# Altium schematic sheet 实验平台2.SchDoc
size D
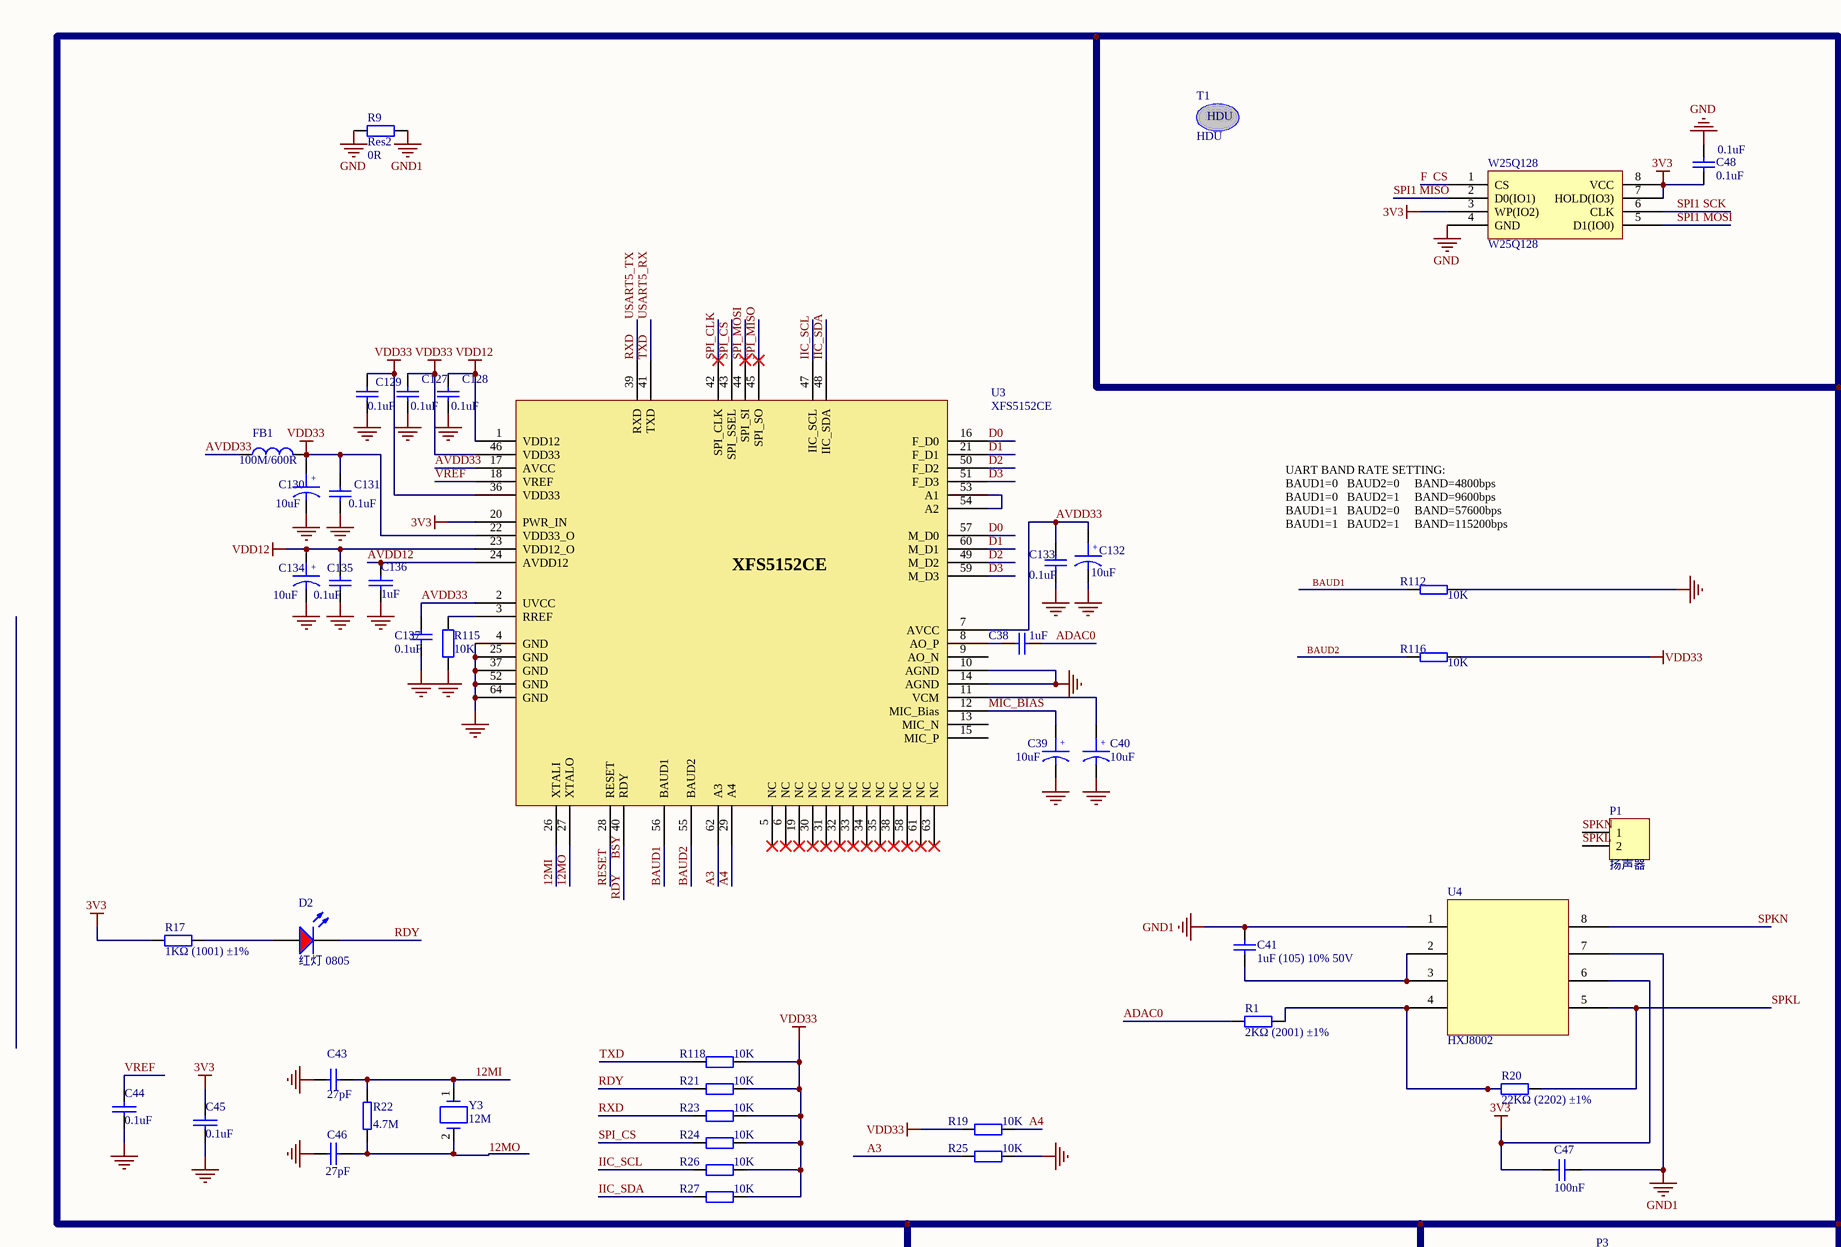
[diagram p0: 实验平台2.SchDoc, top left]
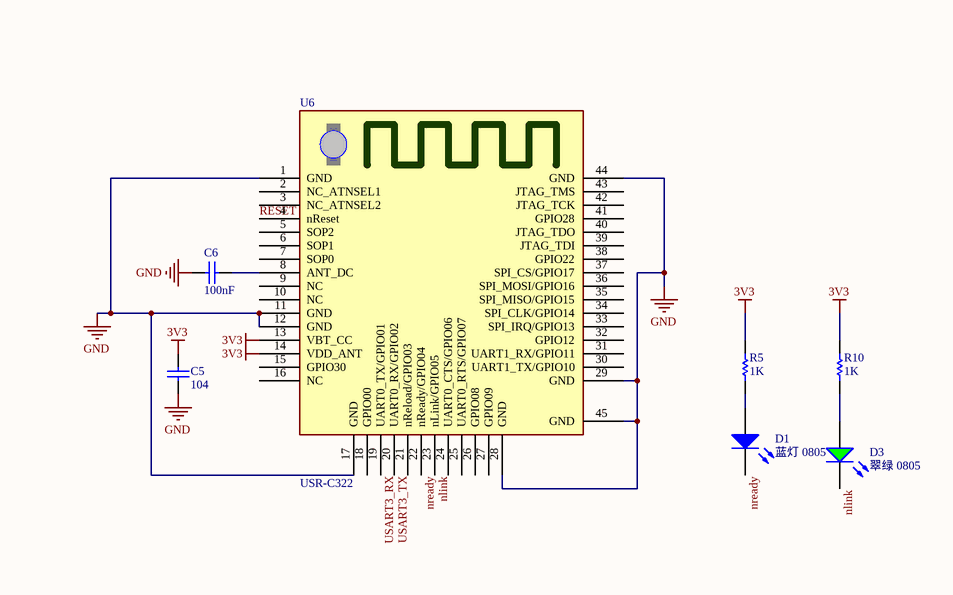
[diagram p1: 实验平台2.SchDoc, top right]
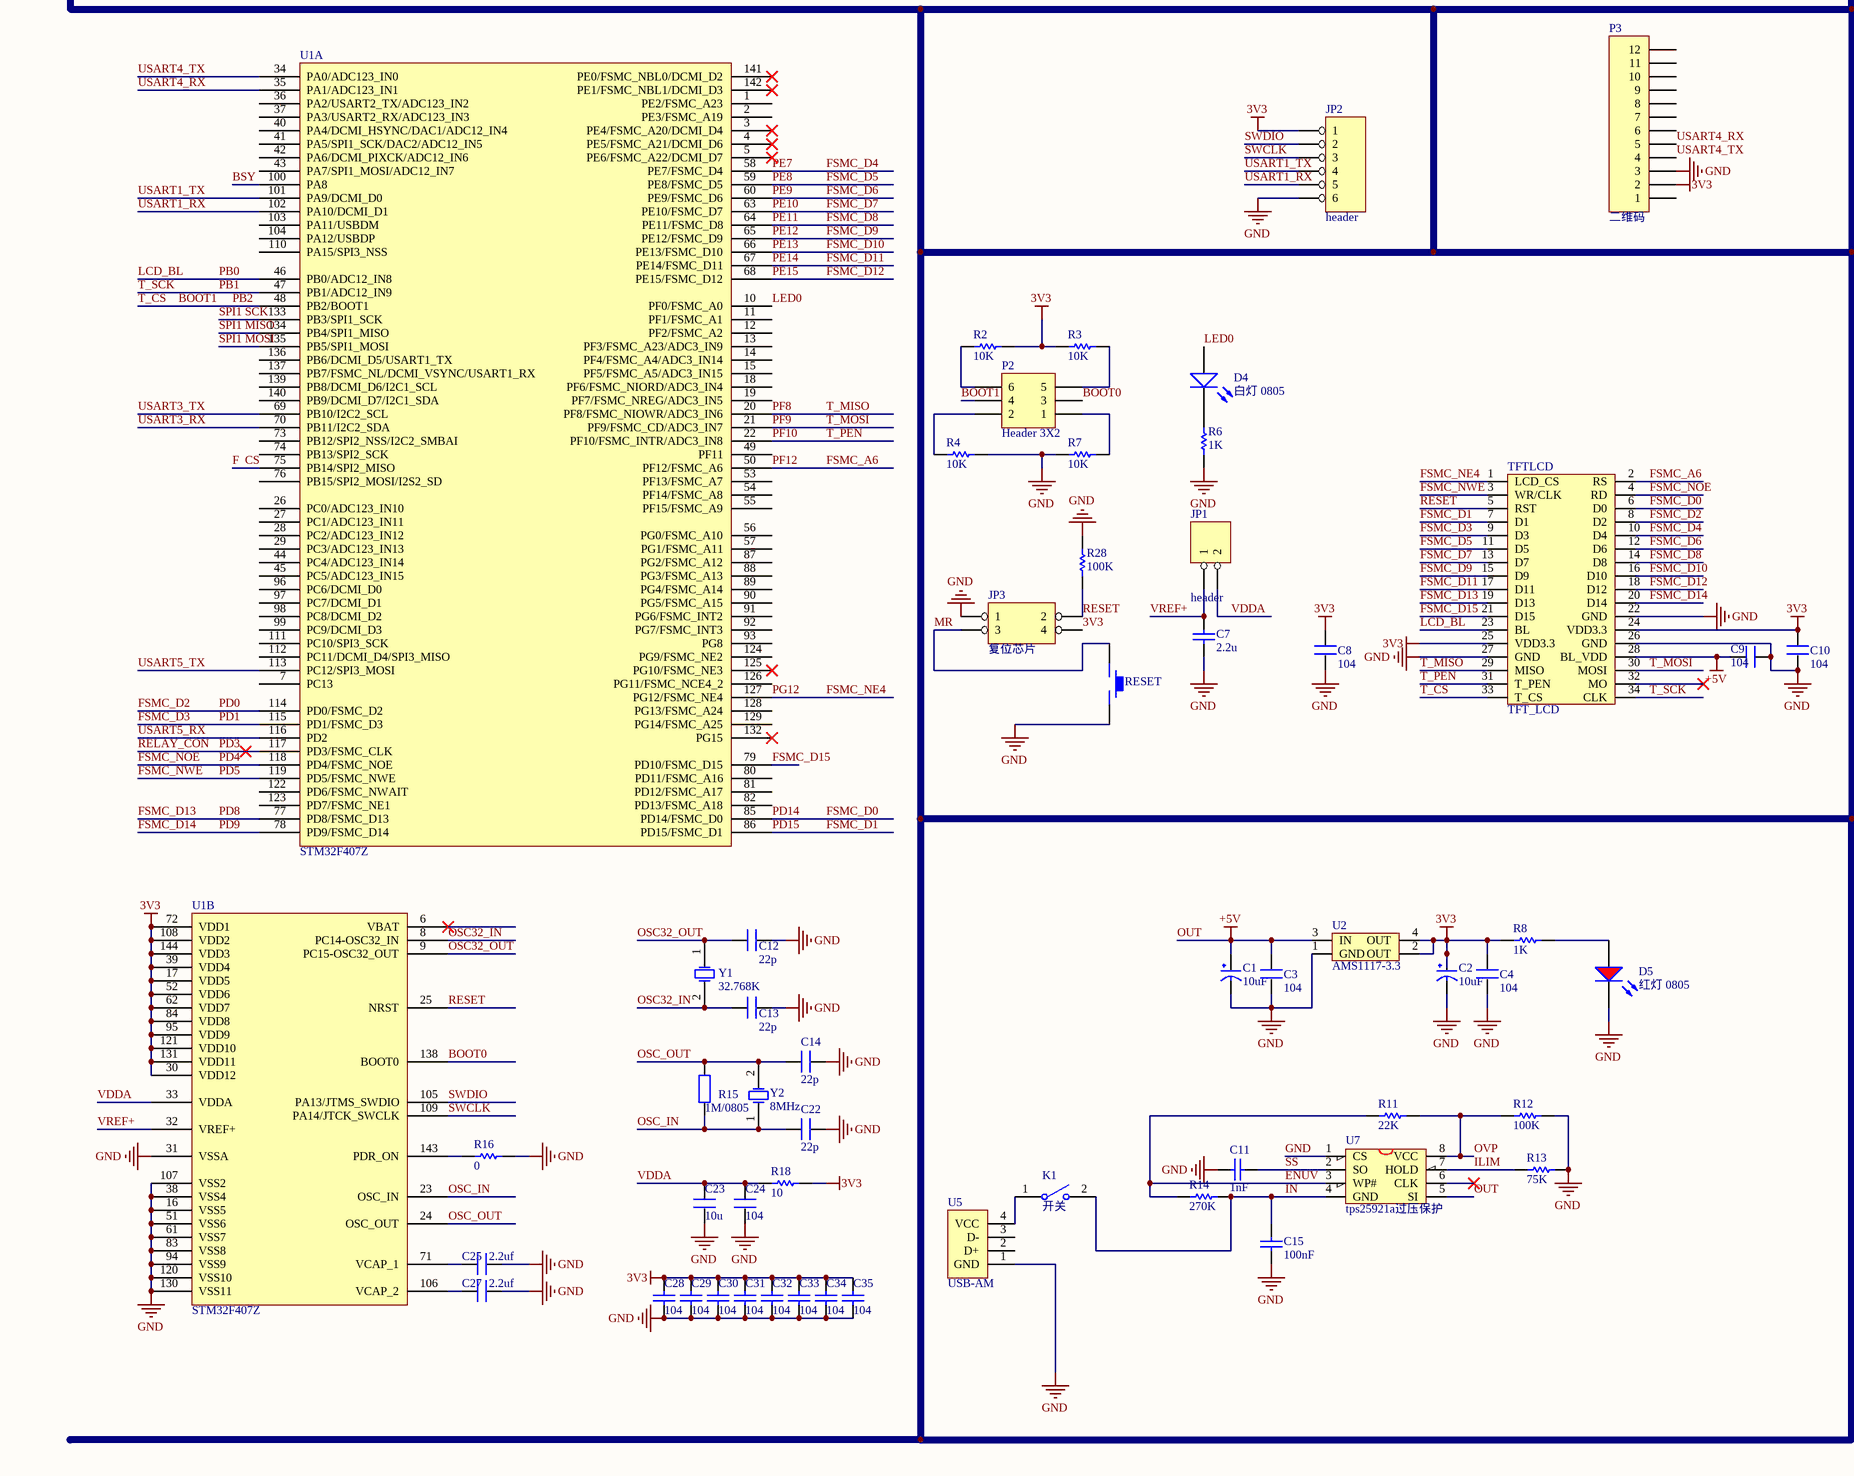
[diagram p2: 实验平台2.SchDoc, bottom left]

## Parts
C1  10uF  [0603_c]
C2  10uF  [0603_c]
C3  104  [0603_c]
C4  104  [0603_c]
C5  104  [0603_c]
C6  100nF  [0603_C]
C7  2.2u  [0603_c]
C8  104  [0603_c]
C9  104  [0603_c]
C10  104  [0603_c]
C11  1nF  [0603_C]
C12  22p  [0603_c]
C13  22p  [0603_c]
C14  22p  [0603_c]
C15  100nF  [0603_C]
C22  22p  [0603_c]
C23  10u  [0603_c]
C24  104  [0603_c]
C25  2.2uf  [0603_c]
C27  2.2uf  [0603_c]
C28  104  [0603_c]
C29  104  [0603_c]
C30  104  [0603_c]
C31  104  [0603_c]
C32  104  [0603_c]
C33  104  [0603_c]
C34  104  [0603_c]
C35  104  [0603_c]
C38  1uF  [C0603(1608)]
C39  10uF  [C0603(1608)]
C40  10uF  [C0603(1608)]
C41  1uF (105) 10% 50V  [0603_C]
C43  27pF  [C0603(1608)]
C44  0.1uF  [C0603(1608)]
C45  0.1uF  [C0603(1608)]
C46  27pF  [C0603(1608)]
C47  100nF  [C-0603]
C48  0.1uF  [0603_C]
C127  0.1uF  [C0603(1608)]
C128  0.1uF  [C0603(1608)]
C129  0.1uF  [C0603(1608)]
C130  10uF  [C0603(1608)]
C131  0.1uF  [C0603(1608)]
C132  10uF  [C0603(1608)]
C133  0.1uF  [C0603(1608)]
C134  10uF  [C0603(1608)]
C135  0.1uF  [C0603(1608)]
C136  1uF  [C0603(1608)]
C137  0.1uF  [C0603(1608)]
D1  蓝灯 0805  [0805_LED_S1]
D2  红灯 0805  [0805_LED_S1]
D3  翠绿 0805  [0805_LED_S1]
D4  白灯 0805  [0805_LED_S1]
D5  红灯 0805  [0805_LED_S1]
FB1  100M/600R  [B0603]
JP1  header  [header2]
JP2  header  [header6HA]
JP3  复位芯片  [SOT-143_M]
K1  开关  [kaiguan]
P1  扬声器  [HDR1X2]
P2  Header 3X2  [HDR2X3]
P3  二维码  [FH12A-12S-0.5sH]
R1  2KΩ (2001) ±1%  [0603_R]
R2  10K  [0603_r]
R3  10K  [0603_r]
R4  10K  [0603_r]
R5  1K  [0603_R]
R6  1K  [0603_r]
R7  10K  [0603_r]
R8  1K  [0603_R]
R9  Res2  value 0R  [0805_r]
R10  1K  [0603_R]
R11  22K  [0603_R]
R12  100K  [0603_R]
R13  75K  [0603_R]
R14  270K  [0603_R]
R15  1M/0805  [0603_r]
R16  0  [0603_r]
R17  1KΩ (1001) ±1%  [0603_R]
R18  10  [0603_r]
R19  10K  [R0603]
R20  22KΩ (2202) ±1%  [0603_R]
R21  10K  [R0603]
R22  4.7M  [R0603]
R23  10K  [R0603]
R24  10K  [R0603]
R25  10K  [R0603]
R26  10K  [R0603]
R27  10K  [R0603]
R28  100K  [0603_R]
R112  10K  [R0603]
R115  10K  [R0603]
R116  10K  [R0603]
R118  10K  [R0603]
RESET  KEY_M  [KEY_M]  (value not drawn)
T1  HDU  [HDU]
TFTLCD  TFT_LCD  [HDR2X17]
U1  STM32F407Z  [LQFP144]  (parts A,B of 2)
U2  AMS1117-3.3  [AMS1117]
U3  XFS5152CE  [LQFP-64_10x10x05P]
U4  HXJ8002  [SOIC-8]
U5  USB-AM  [USB_AM]
U6  USR-C322  [USR-C322-PCB]
U7  tps25921a过压保护  [SOIC-8]
W25Q128  W25Q128  [SO-8N]
Y1  32.768K  [XTAL_32]
Y2  8MHz  [XTAL_2]
Y3  12M  [XTAL_2]

## Nets
3V3: C2.1(VCC) C4.2 C5.2 C8.2 C10.1 C28.2 C29.2 C30.2 C31.2 C32.2 C33.2 C34.2 C35.2 C45.1 C47.1 C48.1 JP2.1 JP3.4 P3.2 R2.2 R3.1 R5.2 R8.1 R10.2 R17.1 R18.1 TFTLCD.24(VDD3.3) TFTLCD.25(VDD3.3) U1.17(VDD5) U1.30(VDD12) U1.39(VDD4) U1.52(VDD6) U1.62(VDD7) U1.72(VDD1) U1.84(VDD8) U1.95(VDD9) U1.108(VDD2) U1.121(VDD10) U1.131(VDD11) U1.144(VDD3) U2.2(OUT) U2.4(OUT) U3.20(PWR_IN) U4.6(2IN-) U6.13(VBT_CC) U6.14(VDD_ANT) W25Q128.3(WP(IO2)) W25Q128.7(HOLD(IO3)) W25Q128.8(VCC)
GND: C1.2(GND) C2.2(GND) C3.1 C4.1 C5.1 C6.1 C7.1 C8.1 C9.2 C10.2 C11.2 C12.1 C13.1 C14.2 C15.1 C22.2 C23.1 C24.1 C25.2 C27.2 C28.1 C29.1 C30.1 C31.1 C32.1 C33.1 C34.1 C35.1 C39.2 C40.2 C43.1 C44.2 C45.2 C46.1 C48.2 C127.1 C128.1 C129.1 C130.2 C131.1 C132.2 C133.1 C134.2 C135.1 C136.2 C137.1 D5.K JP2.6 JP3.1 P3.3 R4.2 R6.1 R7.1 R9.1 R12.2 R13.2 R16.1 R25.1 R28.2 R112.1 R115.1 RESET.2 TFTLCD.22(GND) TFTLCD.26(GND) TFTLCD.27(GND) U1.16(VSS5) U1.31(VSSA) U1.38(VSS4) U1.51(VSS6) U1.61(VSS7) U1.83(VSS8) U1.94(VSS9) U1.107(VSS2) U1.120(VSS10) U1.130(VSS11) U2.1(GND) U3.4(GND) U3.10(AGND) U3.14(AGND) U3.25(GND) U3.37(GND) U3.52(GND) U3.64(GND) U5.1(GND) U6.1(GND) U6.11(GND) U6.12(GND) U6.17(GND) U6.28(GND) U6.29(GND) U6.44(GND) U6.45(GND) U7.1(CS) W25Q128.4(GND)
GND1: C41.2 C47.2 R9.2 U4.1(1OUT) U4.7(2OUT)
OUT: C1.1(VCC) C3.2 C9.1 TFTLCD.28(BL_VDD) U2.3(IN) U7.5(SI)  [also labelled +5V]
VDD12: C128.2 C134.1 C135.2 U3.1(VDD12) U3.23(VDD12_O)
VDD33: C127.2 C129.2 C130.1 C131.2 FB1.2 R19.2 R21.1 R23.1 R24.1 R26.1 R27.1 R116.2 R118.1 U3.22(VDD33_O) U3.36(VDD33) U3.46(VDD33)
12MI: C43.2 R22.1 U3.26(XTALI) Y3.1
12MO: C46.2 R22.2 U3.27(XTALO) Y3.2
A3: R25.2 U3.62(A3)
A4: R19.1 U3.29(A4)
ADAC0: C38.1 R1.1
AVDD12: C136.1 U3.24(AVDD12)
AVDD33: C132.1 C133.2 C137.2 FB1.1 U3.2(UVCC) U3.7(AVCC) U3.17(AVCC)
BAUD1: R112.2 U3.56(BAUD1)
BAUD2: R116.1 U3.55(BAUD2)
BOOT0: P2.3 U1.138(BOOT0)
BOOT1: P2.4 TFTLCD.33(T_CS) U1.48(PB2/BOOT1)  [also labelled PB2, T_CS]
BSY: D2.K R21.2 U1.100(PA8) U3.40(RDY)  [also labelled RDY]
D0: U3.16(F_D0) U3.57(M_D0)
D1: U3.21(F_D1) U3.60(M_D1)
D2: U3.49(M_D2) U3.50(F_D2)
D3: U3.51(F_D3) U3.59(M_D3)
ENUV: R11.1 R14.1 U7.3(WP#)
F  CS: U1.75(PB14/SPI2_MISO) W25Q128.1(CS)
FSMC_A6: TFTLCD.2(RS) U1.50(PF12/FSMC_A6)  [also labelled PF12]
FSMC_D0: TFTLCD.6(D0) U1.85(PD14/FSMC_D0)  [also labelled PD14]
FSMC_D1: TFTLCD.7(D1) U1.86(PD15/FSMC_D1)  [also labelled PD15]
FSMC_D2: TFTLCD.8(D2) U1.114(PD0/FSMC_D2)  [also labelled PD0]
FSMC_D3: TFTLCD.9(D3) U1.115(PD1/FSMC_D3)  [also labelled PD1]
FSMC_D4: TFTLCD.10(D4) U1.58(PE7/FSMC_D4)  [also labelled PE7]
FSMC_D5: TFTLCD.11(D5) U1.59(PE8/FSMC_D5)  [also labelled PE8]
FSMC_D6: TFTLCD.12(D6) U1.60(PE9/FSMC_D6)  [also labelled PE9]
FSMC_D7: TFTLCD.13(D7) U1.63(PE10/FSMC_D7)  [also labelled PE10]
FSMC_D8: TFTLCD.14(D8) U1.64(PE11/FSMC_D8)  [also labelled PE11]
FSMC_D9: TFTLCD.15(D9) U1.65(PE12/FSMC_D9)  [also labelled PE12]
FSMC_D10: TFTLCD.16(D10) U1.66(PE13/FSMC_D10)  [also labelled PE13]
FSMC_D11: TFTLCD.17(D11) U1.67(PE14/FSMC_D11)  [also labelled PE14]
FSMC_D12: TFTLCD.18(D12) U1.68(PE15/FSMC_D12)  [also labelled PE15]
FSMC_D13: TFTLCD.19(D13) U1.77(PD8/FSMC_D13)  [also labelled PD8]
FSMC_D14: TFTLCD.20(D14) U1.78(PD9/FSMC_D14)  [also labelled PD9]
FSMC_D15: TFTLCD.21(D15) U1.79(PD10/FSMC_D15)
FSMC_NE4: TFTLCD.1(LCD_CS) U1.127(PG12/FSMC_NE4)  [also labelled PG12]
FSMC_NOE: TFTLCD.4(RD) U1.118(PD4/FSMC_NOE)  [also labelled PD4]
FSMC_NWE: TFTLCD.3(WR/CLK) U1.119(PD5/FSMC_NWE)  [also labelled PD5]
IIC_SCL: R26.2 U3.47(IIC_SCL)
IIC_SDA: R27.2 U3.48(IIC_SDA)
ILIM: R13.1 U7.7(HOLD)
IN: C15.2 K1.2(NO) R14.2 U7.4(GND)
LCD_BL: TFTLCD.23(BL) U1.46(PB0/ADC12_IN8)  [also labelled PB0]
LED0: D4.A U1.10(PF0/FSMC_A0)
MIC_BIAS: C39.1 U3.12(MIC_Bias)
MR: JP3.3 RESET.1
nlink: D3.K U6.23(nLink/GPIO05)
nready: D1.K U6.22(nReady/GPIO04)
OSC32_IN: C13.2 U1.8(PC14-OSC32_IN) Y1.2(OSC2)
OSC32_OUT: C12.2 U1.9(PC15-OSC32_OUT) Y1.1(OSC1)
OSC_IN: C22.1 R15.1 U1.23(OSC_IN) Y2.1(OSC1)
OSC_OUT: C14.1 R15.2 U1.24(OSC_OUT) Y2.2(OSC2)
OVP: R11.2 R12.1 U7.8(VCC)
PB1: TFTLCD.34(CLK) U1.47(PB1/ADC12_IN9)  [also labelled T_SCK]
PD3: U1.117(PD3/FSMC_CLK)  [also labelled RELAY_CON]
PF8: TFTLCD.29(MISO) U1.20(PF8/FSMC_NIOWR/ADC3_IN6)  [also labelled T_MISO]
PF9: TFTLCD.30(MOSI) U1.21(PF9/FSMC_CD/ADC3_IN7)  [also labelled T_MOSI]
PF10: TFTLCD.31(T_PEN) U1.22(PF10/FSMC_INTR/ADC3_IN8)  [also labelled T_PEN]
RESET: JP3.2 R28.1 TFTLCD.5(RST) U1.25(NRST) U3.28(RESET) U6.4(nReset)
RXD: R23.2 U1.113(PC12/SPI3_MOSI) U3.39(RXD)  [also labelled USART5_TX]
SPI1 MISO: U1.134(PB4/SPI1_MISO) W25Q128.2(D0(IO1))
SPI1 MOSI: U1.135(PB5/SPI1_MOSI) W25Q128.5(D1(IO0))
SPI1 SCK: U1.133(PB3/SPI1_SCK) W25Q128.6(CLK)
SPI_CLK: U3.42(SPI_CLK)
SPI_CS: R24.2 U3.43(SPI_SSEL)
SPI_MISO: U3.45(SPI_SO)
SPI_MOSI: U3.44(SPI_SI)
SPKL: P1.2 R20.2 U4.5(2IN+)
SPKN: P1.1 U4.8(VCC)
SS: C11.1 U7.2(SO)
SWCLK: JP2.3 U1.109(PA14/JTCK_SWCLK)
SWDIO: JP2.2 U1.105(PA13/JTMS_SWDIO)
TXD: R118.2 U1.116(PD2) U3.41(TXD)  [also labelled USART5_RX]
USART1_RX: JP2.5 U1.102(PA10/DCMI_D1)
USART1_TX: JP2.4 U1.101(PA9/DCMI_D0)
USART3_RX: U1.70(PB11/I2C2_SDA) U6.19(UART0_TX/GPIO01)
USART3_TX: U1.69(PB10/I2C2_SCL) U6.20(UART0_RX/GPIO02)
USART4_RX: P3.5 U1.35(PA1/ADC123_IN1)
USART4_TX: P3.4 U1.34(PA0/ADC123_IN0)
VDDA: C23.2 C24.2 JP1.2 R18.2 U1.33(VDDA)
VREF: C44.1 U3.18(VREF)
VREF+: C7.2 JP1.1 U1.32(VREF+)
NetC6_2: C6.2 U6.8(ANT_DC)
NetC25_1: C25.1 U1.71(VCAP_1)
NetC27_1: C27.1 U1.106(VCAP_2)
NetC38_2: C38.2 U3.8(AO_P)
NetC40_1: C40.1 U3.11(VCM)
NetC41_1: C41.1 U4.2(1IN-) U4.3(1IN+)
NetD1_A: D1.A R5.1
NetD2_A: D2.A R17.2
NetD3_A: D3.A R10.1
NetD4_K: D4.K R6.2
NetD5_A: D5.A R8.2
NetK1_1: K1.1(COMMON) U5.4(VCC)
NetP2_1: P2.1 R7.2
NetP2_2: P2.2 R4.1
NetP2_5: P2.5 R3.2
NetP2_6: P2.6 R2.1
NetR1_2: R1.2 R20.1 U4.4(GND)
NetR16_2: R16.2 U1.143(PDR_ON)
NetR115_2: R115.2 U3.3(RREF)
NetU3_53: U3.53(A1) U3.54(A2)

Not connected (* = marked no-connect by the designer): P3 1 6 7 8 9 10 11 12; TFTLCD 32(MO)*; U1 1(PE2/FSMC_A23) 2(PE3/FSMC_A19) 3(PE4/FSMC_A20/DCMI_D4)* 4(PE5/FSMC_A21/DCMI_D6)* 5(PE6/FSMC_A22/DCMI_D7)* 6(VBAT)* 7(PC13) 11(PF1/FSMC_A1) 12(PF2/FSMC_A2) 13(PF3/FSMC_A23/ADC3_IN9) 14(PF4/FSMC_A4/ADC3_IN14) 15(PF5/FSMC_A5/ADC3_IN15) 18(PF6/FSMC_NIORD/ADC3_IN4) 19(PF7/FSMC_NREG/ADC3_IN5) 26(PC0/ADC123_IN10) 27(PC1/ADC123_IN11) 28(PC2/ADC123_IN12) 29(PC3/ADC123_IN13) 36(PA2/USART2_TX/ADC123_IN2) 37(PA3/USART2_RX/ADC123_IN3) 40(PA4/DCMI_HSYNC/DAC1/ADC12_IN4) 41(PA5/SPI1_SCK/DAC2/ADC12_IN5) 42(PA6/DCMI_PIXCK/ADC12_IN6) 43(PA7/SPI1_MOSI/ADC12_IN7) 44(PC4/ADC123_IN14) 45(PC5/ADC123_IN15) 49(PF11) 53(PF13/FSMC_A7) 54(PF14/FSMC_A8) 55(PF15/FSMC_A9) 56(PG0/FSMC_A10) 57(PG1/FSMC_A11) 73(PB12/SPI2_NSS/I2C2_SMBAI) 74(PB13/SPI2_SCK) 76(PB15/SPI2_MOSI/I2S2_SD) 80(PD11/FSMC_A16) 81(PD12/FSMC_A17) 82(PD13/FSMC_A18) 87(PG2/FSMC_A12) 88(PG3/FSMC_A13) 89(PG4/FSMC_A14) 90(PG5/FSMC_A15) 91(PG6/FSMC_INT2) 92(PG7/FSMC_INT3) 93(PG8) 96(PC6/DCMI_D0) 97(PC7/DCMI_D1) 98(PC8/DCMI_D2) 99(PC9/DCMI_D3) 103(PA11/USBDM) 104(PA12/USBDP) 110(PA15/SPI3_NSS) 111(PC10/SPI3_SCK) 112(PC11/DCMI_D4/SPI3_MISO) 122(PD6/FSMC_NWAIT) 123(PD7/FSMC_NE1) 124(PG9/FSMC_NE2) 125(PG10/FSMC_NE3)* 126(PG11/FSMC_NCE4_2) 128(PG13/FSMC_A24) 129(PG14/FSMC_A25) 132(PG15)* 136(PB6/DCMI_D5/USART1_TX) 137(PB7/FSMC_NL/DCMI_VSYNC/USART1_RX) 139(PB8/DCMI_D6/I2C1_SCL) 140(PB9/DCMI_D7/I2C1_SDA) 141(PE0/FSMC_NBL0/DCMI_D2)* 142(PE1/FSMC_NBL1/DCMI_D3)*; U3 5(NC)* 6(NC)* 9(AO_N) 13(MIC_N) 15(MIC_P) 19(NC)* 30(NC)* 31(NC)* 32(NC)* 33(NC)* 34(NC)* 35(NC)* 38(NC)* 58(NC)* 61(NC)* 63(NC)*; U5 2(D+) 3(D-); U6 2(NC_ATNSEL1) 3(NC_ATNSEL2) 5(SOP2) 6(SOP1) 7(SOP0) 9(NC) 10(NC) 15(GPIO30) 16(NC) 18(GPIO00) 21(nReload/GPIO03) 24(UART0_CTS/GPIO06) 25(UART0_RTS/GPIO07) 26(GPIO08) 27(GPIO09) 30(UART1_TX/GPIO10) 31(UART1_RX/GPIO11) 32(GPIO12) 33(SPI_IRQ/GPIO13) 34(SPI_CLK/GPIO14) 35(SPI_MISO/GPIO15) 36(SPI_MOSI/GPIO16) 37(SPI_CS/GPIO17) 38(GPIO22) 39(JTAG_TDI) 40(JTAG_TDO) 41(GPIO28) 42(JTAG_TCK) 43(JTAG_TMS); U7 6(CLK)*

## Notes on the sheet
- UART BAND RATE SETTING:
  BAUD1=0   BAUD2=0     BAND=4800bps
  BAUD1=0   BAUD2=1     BAND=9600bps
  BAUD1=1   BAUD2=0     BAND=57600bps
  BAUD1=1   BAUD2=1     BAND=115200bps
- (in symbol CAP POL) +

## Library data of the parts
C1 C2 = CAP
C3 C4 C8-C10 = C_3
C5 C28-C35 C44 C45 C136 = CAP: Capacitor
  C5 C28-C35: Published: 8-Jun-2000; LatestRevisionDate: 17-Jul-2002; LatestRevisionNote: Re-released for DXP Platform.; PackageReference: RAD-0.3; Publisher: Altium Limited; Value: 104
C6 C7 C11 C15 = CAP: Capacitor; Value: 104; Published: 8-Jun-2000; LatestRevisionDate: 17-Jul-2002; LatestRevisionNote: Re-released for DXP Platform.; PackageReference: RAD-0.3; Publisher: Altium Limited
C12-C14 C22-C25 C27 = C_1
C38 C43 C46 C127-C129 C131 C133 C135 C137 = Cap NP: 电容; Published: 8-Jun-2000; LatestRevisionDate: 17-Jul-2002; LatestRevisionNote: Re-released for DXP Platform.; Publisher: Altium Limited
C39 C40 C130 C132 C134 = CAP POL: Part package: 6032
C41 = 0603 1uF (105) 10% 50V: 贴片电容; ComponentLink1Description: 供应商链接; ComponentLink1URL: http://www.szlcsc.com/product/details_16531.html; Package: 0603; Supplier: LC; SuppliersPartNumber: C15849
C47 = 0805 10uF (106) 10% 25V: 贴片电容; ComponentLink1Description: 供应商链接; ComponentLink1URL: http://www.szlcsc.com/product/details_16532.html; Package: 0805; Supplier: LC; SuppliersPartNumber: C15850
C48 = Cap: Capacitor; Published: 8-Jun-2000; LatestRevisionDate: 17-Jul-2002; LatestRevisionNote: Re-released for DXP Platform.; PackageReference: RAD-0.3; Publisher: Altium Limited; PackageDescription: Radial Cap, Thru-Hole; 2 Leads; 0.3 in Pin Spacing; Value: 0.1uF
D1 = 0805 蓝灯: 发光二极管; ComponentLink1Description: 供应商链接; ComponentLink1URL: http://www.szlcsc.com/product/details_2666.html; Package: 0805; Supplier: LC; SuppliersPartNumber: C2293
D2 D5 = 0805 红灯: 发光二极管; ComponentLink1Description: 供应商链接; ComponentLink1URL: http://www.szlcsc.com/product/details_2668.html; Package: 0805; Supplier: LC; SuppliersPartNumber: C2295
D3 = 0805 翠绿: 发光二极管; ComponentLink1Description: 供应商链接; ComponentLink1URL: http://www.szlcsc.com/product/details_2670.html; Package: 0805; Supplier: LC; SuppliersPartNumber: C2297
D4 = 0805 白灯: 发光二极管; ComponentLink1Description: 供应商链接; ComponentLink1URL: http://www.szlcsc.com/product/details_35468.html; Package: 0805; Supplier: LC; SuppliersPartNumber: C34499
FB1 = Fbead: 磁珠; Code_IEC: 1005; Published: 8-Jun-2000; LatestRevisionDate: 17-Jul-2002; LatestRevisionNote: Re-released for DXP Platform.; PackageReference: 0402-A; Publisher: Altium Limited; Code_JEITA: 0402
JP1 = HEADER 2
JP2 = HEADER 6
JP3 = HEADER 2X2
P1 = Header 2: Header, 2-Pin; LatestRevisionDate: 17-Jul-2002; LatestRevisionNote: Re-released for DXP Platform.; Publisher: Altium Limited
P2 = Header 3X2: Header, 3-Pin, Dual row; LatestRevisionDate: 17-Jul-2002; LatestRevisionNote: Re-released for DXP Platform.; Publisher: Altium Limited
P3 = Header 12: Header, 12-Pin; LatestRevisionDate: 17-Jul-2002; LatestRevisionNote: Re-released for DXP Platform.; Publisher: Altium Limited
R1 = 0603 2KΩ (2001) 1%: 贴片电阻; ComponentLink1Description: 供应商链接; ComponentLink1URL: http://www.szlcsc.com/product/details_23702.html; Package: 0603; Supplier: LC; SuppliersPartNumber: C22975
R2-R4 R7 R11-R14 R16 R18 R28 = RES: Resistor; Value: 1K; Published: 8-Jun-2000; Revision: July-2002: Re-released for DXP Platform.; Publisher: Altium Limited
R5 R6 R8 R10 = RES: Resistor; Published: 8-Jun-2000; Revision: July-2002: Re-released for DXP Platform.; Publisher: Altium Limited; Value: 1K
R9 R15 R19 R21 R23-R27 R115 R118 = Res2: Resistor; Published: 8-Jun-2000; LatestRevisionDate: 17-Jul-2002; LatestRevisionNote: Re-released for DXP Platform.; Publisher: Altium Limited
  R9: PackageReference: AXIAL-0.4; PackageDescription: Axial Device, Thru-Hole; 2 Leads; 0.4 in Pin Spacing
  R115: PackageReference: AXIAL-0.4; Value: 10K
R17 = 0805 1KΩ (1001) 1%: 贴片电阻; ComponentLink1Description: 供应商链接; ComponentLink1URL: http://www.szlcsc.com/product/details_18201.html; Package: 0805; Supplier: LC; SuppliersPartNumber: C17513
R20 = 0805 22KΩ (2202) 1%: 贴片电阻; ComponentLink1Description: 供应商链接; ComponentLink1URL: http://www.szlcsc.com/product/details_18248.html; Package: 0805; Supplier: LC; SuppliersPartNumber: C17560
R22 R112 R116 = RES2: 电阻
U1 = STM32F407Z: STM32单片机144引脚
U2 = AMS1117
U3 = XFS5152-2
U4 = LM358
U5 = USB-AM: Data line
U7 = W25X16: W25X16;SST25VF016;MX25L1605
Y1 = XTAL_1: Crystal Oscillator; Published: 8-Jun-2000; LatestRevisionDate: 17-Jul-2002; LatestRevisionNote: Re-released for DXP Platform.; Publisher: Altium Limited
Y2 = XTAL: Crystal Oscillator; Published: 8-Jun-2000; LatestRevisionDate: 17-Jul-2002; LatestRevisionNote: Re-released for DXP Platform.; Publisher: Altium Limited
Y3 = XTAL1: 晶振